# Altium schematic sheet ABS_ngli.SchDoc
size A
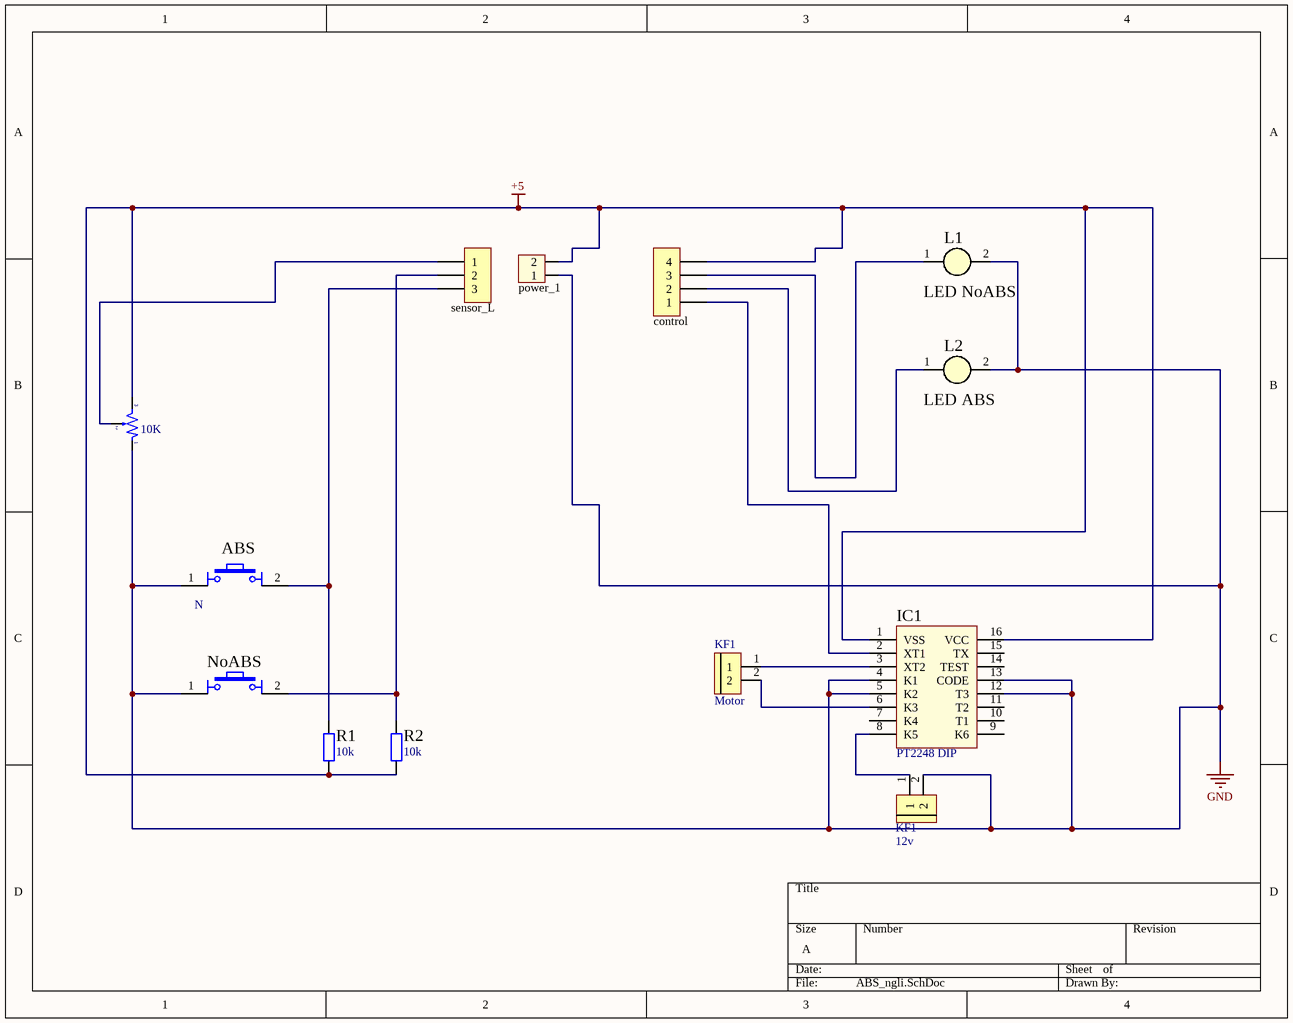
[diagram p0: ABS_ngli.SchDoc]

## Parts
(Parts that share a designator on the sheet are numbered #1, #2 ... from top to bottom, then left to right.)
?  10K  [Bien Tro Volume Don]
ABS  N  [Nut Nhan 4 Chan Cam 6x6]
H?#1  sensor_L  [VH3.96M-3]
H?#2  power_1  [VH3.96M-2]
H?#3  control  [VH3.96M-4]
IC1  PT2248 DIP  [DIP16]
KF1#1  Motor  [Con 2 KF301 5.08]
KF1#2  12v  [Con 2 KF301 5.08]
L1  LED NoABS  [LED-5MM-WHITE]
L2  LED ABS  [LED-5MM-WHITE]
NoABS  (no value)  [Nut Nhan 4 Chan Cam 6x6]
R1  10k  [tro vach 1/2w]
R2  10k  [tro vach 1/2w]

## Nets
+5: ?.3 H?#2.2 H?#3.4 IC1.1(VSS) IC1.16(VCC) R1.1 R2.1
GND: ?.1 ABS.1 H?#2.1 IC1.4(K1) IC1.5(K2) IC1.12(T3) IC1.13(CODE) KF1#2.2 L1.2(K) L2.2(K) NoABS.1
Net?_2: ?.2 H?#1.1
NetABS_2: ABS.2 H?#1.3 R1.2
NetH?#1_2: H?#1.2 NoABS.2 R2.2
NetH?#3_1: H?#3.1 IC1.2(XT1)
NetH?#3_2: H?#3.2 L2.1(A)
NetH?#3_3: H?#3.3 L1.1(A)
NetIC1_3: IC1.3(XT2) KF1#1.1
NetIC1_6: IC1.6(K3) KF1#1.2
NetIC1_8: IC1.8(K5) KF1#2.1

Not connected (* = marked no-connect by the designer): IC1 7(K4) 9(K6) 10(T1) 11(T2) 14(TEST) 15(TX)

## Library data of the parts
? = Triet Ap Don 10k: Cắm; Don_Vi: Con; Ten_Linh_Kien: Triết Áp Đơn B10K; Ma_Hang: MH001417; Kieu_Chan: *; Chung_Loai: Cắm
ABS NoABS = Nut Nhan 4 Chan Cam 6x6: Nut Nhan 4 Chan 6x6mm; Ten: Nút Nhấn 4 Chân 6x6x5MM DIP; Ma_Hang: MH004584
H?#1 = Header 3P VH3.96 Duc Thang: Cắm; Ten_Linh_Kien: Header 3P XH2.54-3P Đực Thẳng; Don_Vi: Con; Ma_Hang: MH001292; Chung_Loai: Cắm
H?#2 = Header 2P VH3.96 Duc Thang: Cắm; Ten_Linh_Kien: Header 2P XH2.54-2P Đực Thẳng; Don_Vi: Con; Ma_Hang: MH001283; Chung_Loai: Cắm
H?#3 = Header 4P VH3.96 Duc Thang: Cắm; Ten_Linh_Kien: Header 4P XH2.54-4P Đực Thẳng; Don_Vi: Con; Ma_Hang: MH001285; Chung_Loai: Cắm
IC1 = PT2248 DIP: Cắm; Ten_Linh_Kien: PT2248 DIP16; Don_Vi: Con; Ma_Hang: MH002843; Ghi_Chu: *; Kieu_Chan: *; Chung_Loai: Cắm
KF1#1 KF1#2 = CON 2 KF301: Cắm; Ma_Hang: MH000987; Ten_Linh_Kien: CON 2 KF301-2P 5.08MM Xanh Dương; Don_Vi: Con; Chung_Loai: Cắm; Ghi_Chu: *; Kieu_Chan: *
L1 L2 = LED 5mm Trang: Cắm; Don_Vi: Con; Ma_Hang: MH008983; Ten_Linh_Kien: Led 5MM Trắng Đục (1000c); Ghi_Chu: *; Kieu_Chan: *; Chung_Loai: Cắm
R1 R2 = Tro Vach 1/2W 5% 10k: Cắm; Don_Vi: Con; So_Chan: 2; Ten_Linh_Kien: Trở 5% 1/2w 10k; Ma_Hang: MH006206; Chung_Loai: Cắm; Kieu_Chan: *